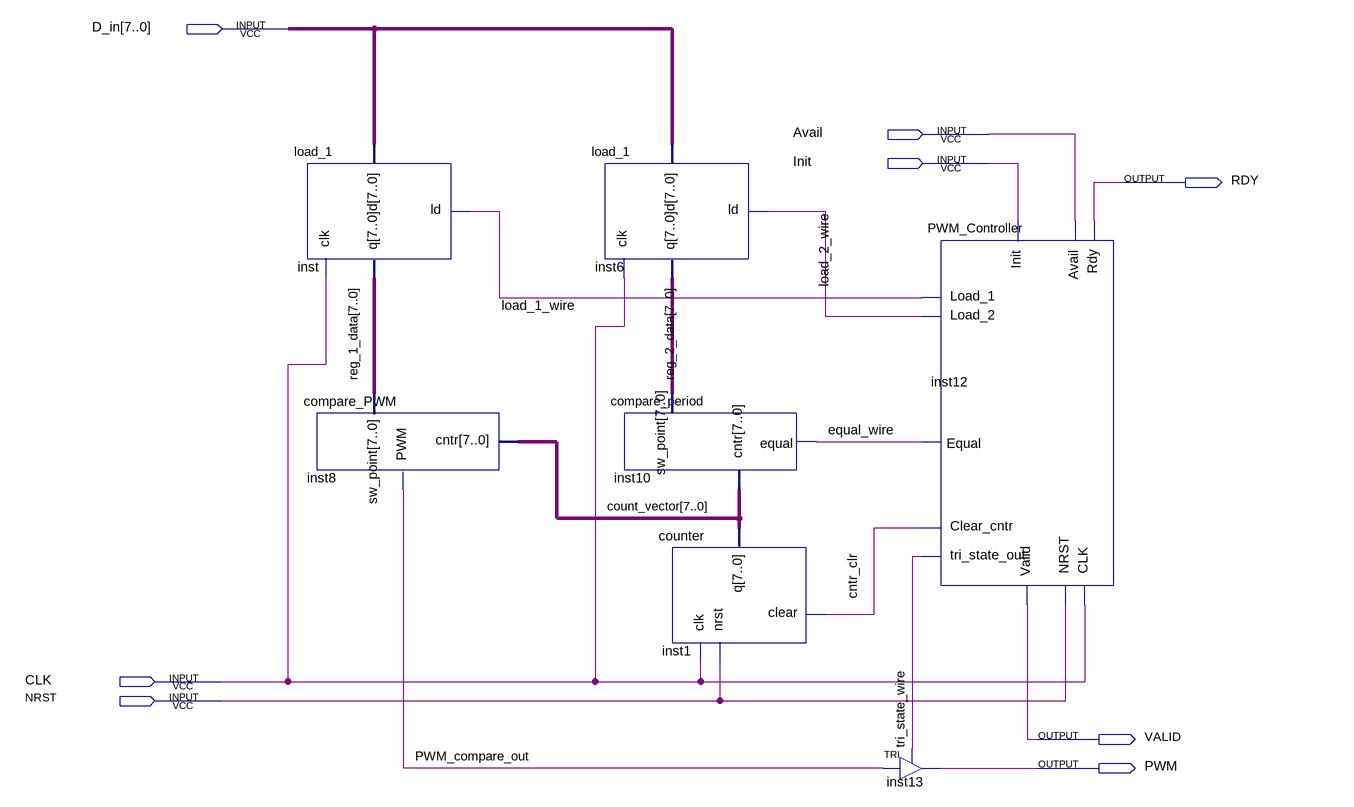
[diagram p0: schematic sheet]
// Quartus schematic PWM_GENERATOR.bdf as structural Verilog: 7 symbols, 8 pins
module PWM_GENERATOR (
  input  [7:0] D_in,
  input  Avail,
  input  Init,
  input  CLK,
  input  NRST,
  output RDY,
  output VALID,
  output PWM
);

  wire cntr_clr, equal_wire, load_1_wire, load_2_wire, PWM_compare_out, tri_state_wire;
  wire [7:0] count_vector, reg_1_data, reg_2_data;

  load_1 inst (.d(D_in), .clk(CLK), .ld(load_1_wire), .q(reg_1_data));
  compare_PWM inst8 (.sw_point(reg_1_data), .cntr(count_vector), .PWM(PWM_compare_out));
  load_1 inst6 (.d(D_in), .clk(CLK), .ld(load_2_wire), .q(reg_2_data));
  compare_period inst10 (.cntr(count_vector), .sw_point(reg_2_data), .equal(equal_wire));
  counter inst1 (.clear(cntr_clr), .clk(CLK), .nrst(NRST), .q(count_vector));
  PWM_Controller inst12 (
    .CLK(CLK), .NRST(NRST), .Init(Init), .Avail(Avail), .Equal(equal_wire), .Rdy(RDY), .Valid(VALID),
    .Load_1(load_1_wire), .Load_2(load_2_wire), .Clear_cntr(cntr_clr), .tri_state_out(tri_state_wire));
  TRI inst13 (.IN(PWM_compare_out), .OE(tri_state_wire), .OUT(PWM));
endmodule
